# Altium schematic sheet EVQ4242-VE-00B_schematic.SchDoc
size A3
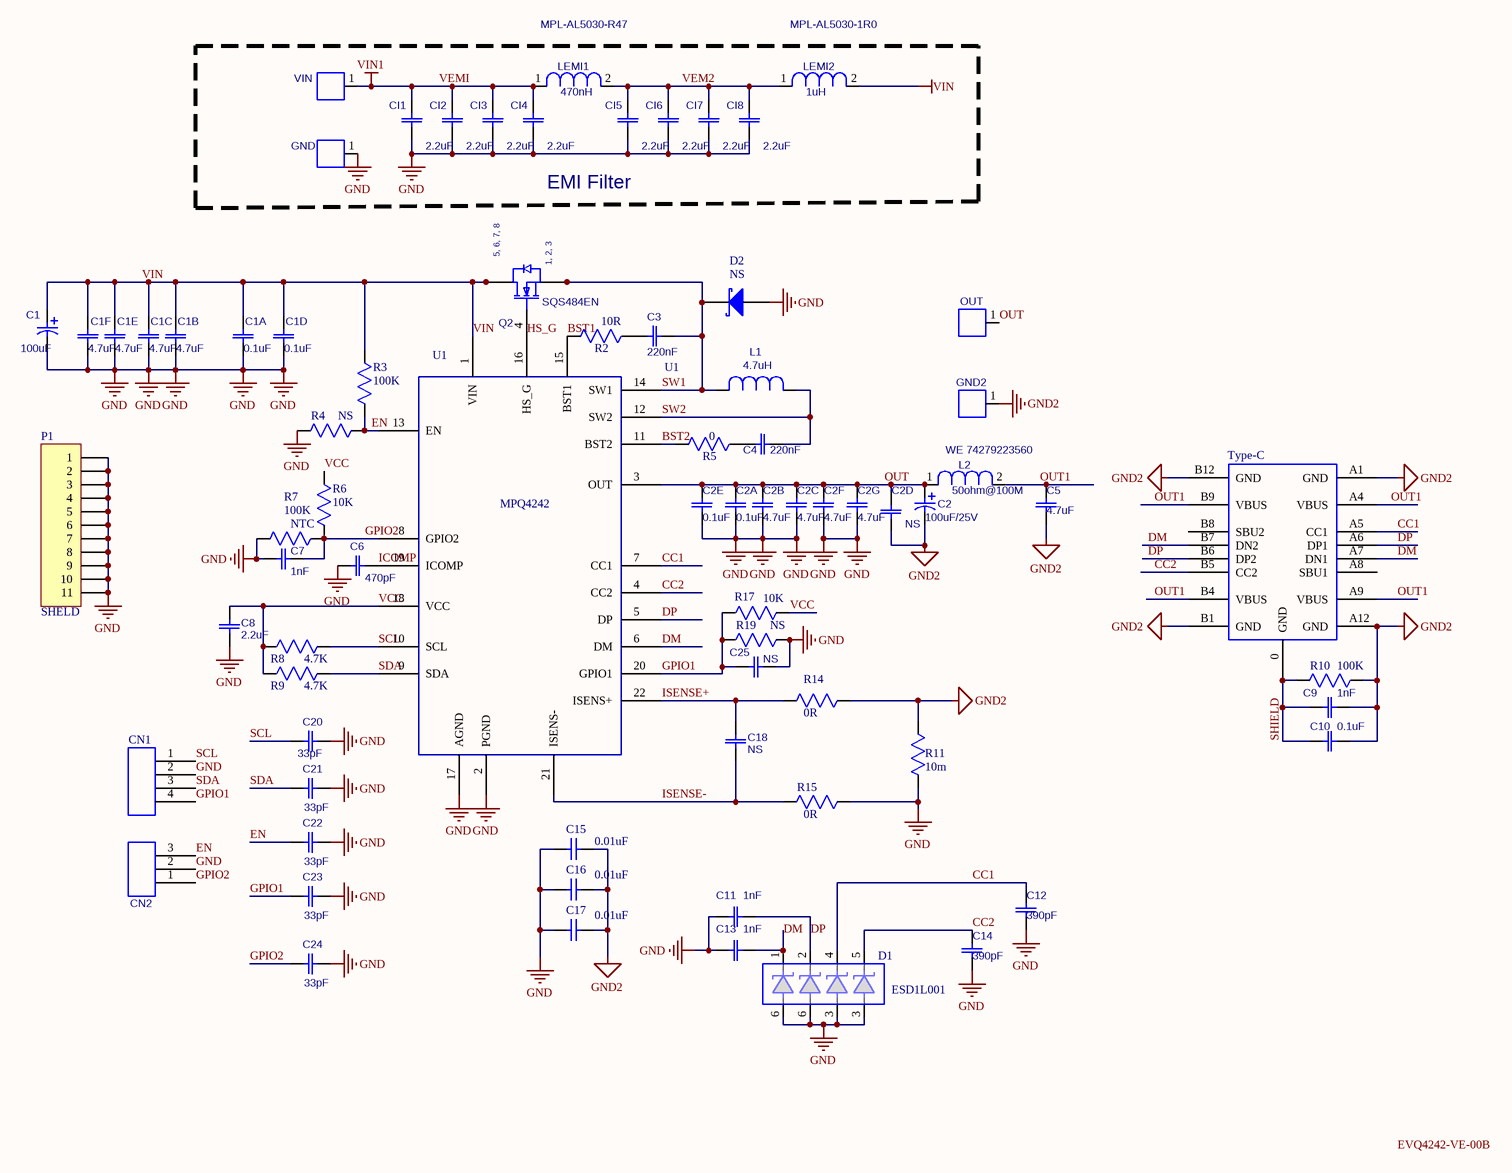
[diagram p0: EVQ4242-VE-00B_schematic.SchDoc]

## Parts
C1  value 100uF  [CAP/ELECT/SMD/C6]  (hidden comment: CAP/ELECT/DIP/OD5.3P2.0)
C1A  value 0.1uF  [CAP/0402]  (hidden comment: CAP\0603)
C1B  value 4.7uF  [CAP/0805]  (hidden comment: CAP\0603)
C1C  value 4.7uF  [CAP/0805]
C1D  value 0.1uF  [CAP/0402]  (hidden comment: CAP\0603)
C1E  value 4.7uF  [CAP/0805]  (hidden comment: CAP\0603)
C1F  value 4.7uF  [CAP/0805]
C2  value 100uF/25V  [6.6mm*6.6mm]  (hidden comment: CAP/ELECT/DIP/OD5.3P2.0)
C2A  value 0.1uF  [CAP/0402]  (hidden comment: CAP\0603)
C2B  value 4.7uF  [CAP/0805]  (hidden comment: CAP\0603)
C2C  value 4.7uF  [CAP/0805]  (hidden comment: CAP\0603)
C2D  value NS  [CAP/0805]  (hidden comment: CAP\0603)
C2E  value 0.1uF  [CAP/0402]  (hidden comment: CAP\0603)
C2F  value 4.7uF  [CAP/0805]  (hidden comment: CAP\0603)
C2G  value 4.7uF  [CAP/0805]  (hidden comment: CAP\0603)
C3  value 220nF  [CAP/0402]  (hidden comment: CAP\0603)
C4  value 220nF  [CAP/0402]  (hidden comment: CAP\0603)
C5  value 4.7uF  [CAP/0603]  (hidden comment: CAP\0603)
C6  value 470pF  [CAP/0402]  (hidden comment: CAP\0603)
C7  value 1nF  [CAP/0603]  (hidden comment: CAP\0603)
C8  value 2.2uF  [CAP/0402]  (hidden comment: CAP\0603)
C9  value 1nF  [CAP/0603]  (hidden comment: CAP\0603)
C10  value 0.1uF  [CAP/0603]  (hidden comment: CAP\0603)
C11  value 1nF  [CAP/0402]  (hidden comment: CAP\0603)
C12  value 390pF  [CAP/0402]  (hidden comment: CAP\0603)
C13  value 1nF  [CAP/0402]  (hidden comment: CAP\0603)
C14  value 390pF  [CAP/0402]  (hidden comment: CAP\0603)
C15  value 0.01uF  [CAP/0402]  (hidden comment: Cap)
C16  value 0.01uF  [CAP/0402]  (hidden comment: Cap)
C17  value 0.01uF  [CAP/0402]  (hidden comment: Cap)
C18  value NS  [CAP/0402]  (hidden comment: CAP\0603)
C20  33pF  [CAP0603]
C21  33pF  [CAP0603]
C22  33pF  [CAP0603]
C23  33pF  [CAP0603]
C24  33pF  [CAP0603]
C25  value NS  [CAP/0603]  (hidden comment: CAP\0603)
CI1  value 2.2uF  [CAP0603]  (hidden comment: CAP0603)
CI2  value 2.2uF  [CAP0603]  (hidden comment: CAP0603)
CI3  value 2.2uF  [CAP0603]  (hidden comment: CAP0603)
CI4  value 2.2uF  [CAP0603]  (hidden comment: CAP0603)
CI5  value 2.2uF  [CAP0603]  (hidden comment: CAP0603)
CI6  value 2.2uF  [CAP0603]  (hidden comment: CAP0603)
CI7  value 2.2uF  [CAP0603]  (hidden comment: CAP0603)
CI8  value 2.2uF  [CAP0603]  (hidden comment: CAP0603)
CN1  HEADER 4  [HEADER 1X4]  (value not drawn)
CN2  AC  [CONN/3PIN/2.54MM]  (value not drawn)
D1  ESD1L001  [ESD0001]
D2  NS  [SOD123]
GND  CONN/1MM  [TP/2MM]  (value not drawn)
GND2  CONN/TP  [TP/2MM]  (value not drawn)
L1  value 4.7uH  [7443551470]  (hidden comment: COILCRAFT/LPO2506IB-682)
L2  value 50ohm@100M  Package: WE 74279223560  [sm1206]  (hidden comment: L-10X10)
LEMI1  value 470nH  Package: MPL-AL5030-R47  [L5030]  (hidden comment: TDK-2520)
LEMI2  value 1uH  Manufacturer P/N: MPL-AL5030-1R0  [L5030]  (hidden comment: TDK-2520)
OUT  CONN/TP  [TP/2MM]  (value not drawn)
P1  SHELD  [sheld]
Q2  SQS484EN  value U1  [SQS484EN]
R2  value 10R  [RES0402]  (hidden comment: RES/DIP/1/2W)
R3  value 100K  [RES0603]  (hidden comment: RES/DIP/1/2W)
R4  value NS  [RES0603]  (hidden comment: RES/DIP/1/2W)
R5  value 0  [RES0402]  (hidden comment: RES/DIP/1/2W)
R6  value 10K  [RES0603]  (hidden comment: RES/DIP/1/2W)
R7  value NTC  [RES0603]  (hidden comment: RES/DIP/1/2W)
R8  value 4.7K  [RES0603]  (hidden comment: RES/DIP/1/2W)
R9  value 4.7K  [RES0603]  (hidden comment: RES/DIP/1/2W)
R10  value 100K  [RES0603]  (hidden comment: RES/DIP/1/2W)
R11  value 10m  [l1508]  (hidden comment: RES/DIP/1/2W)
R14  value 0R  [RES0402]  (hidden comment: RES/DIP/1/2W)
R15  value 0R  [RES0402]  (hidden comment: RES/DIP/1/2W)
R17  value 10K  [RES0603]  (hidden comment: RES/DIP/1/2W)
R19  value NS  [RES0603]  (hidden comment: RES/DIP/1/2W)
Type-C  New Type_c  [New Type-C]  (value not drawn)
U1  MPQ4242  [QFN-22 (4mm×5mm)]
VIN  CONN/2MM  [TP/2MM]  (value not drawn)

## Blocks framed on the sheet
EMI Filter: CI1-CI8 GND LEMI1 LEMI2 VIN

## Nets
GND: C1.2 C1A.1 C1B.1 C1C.1 C1D.1 C1E.1 C1F.1 C2A.2 C2B.2 C2C.2 C2E.2 C2F.2 C2G.2 C6.1 C7.1 C8.2 C11.1 C12.2 C13.1 C14.2 C15.1 C16.1 C17.1 C20.1 C21.1 C22.1 C23.1 C24.1 C25.2 CI1.1 CI2.1 CI3.1 CI4.1 CI5.1 CI6.1 CI7.1 CI8.1 CN1.2 CN2.2 D1.3 D1.6 D2.1(A) GND.1 P1.1 P1.2 P1.3 P1.4 P1.5 P1.6 P1.7 P1.8 P1.9 P1.10 P1.11 R4.2 R7.2 R11.1 R15.2 R19.2 U1.2(PGND) U1.17(AGND)
GND2: C2.2 C2D.2 C5.2 C9.2 C10.2 C15.2 C16.2 C17.2 GND2.1 R10.2 R11.2 R14.1 Type-C.A1(GND) Type-C.A12(GND) Type-C.B1(GND) Type-C.B12(GND)
VEMI: CI1.2 CI2.2 CI3.2 CI4.2 LEMI1.1 VIN.1  [also labelled VIN1]
VIN: C1.1 C1A.2 C1B.2 C1C.2 C1D.2 C1E.2 C1F.2 LEMI2.2 Q2.5(D) Q2.6(D) Q2.7(D) Q2.8(D) R3.2 U1.1(VIN)
BST1: R2.1 U1.15(BST1)
BST2: R5.1 U1.11(BST2)
CC1: C12.1 D1.4 Type-C.A5(CC1) U1.7(CC1)
CC2: C14.1 D1.5 Type-C.B5(CC2) U1.4(CC2)
DM: C13.2 D1.1 Type-C.A7(DN1) Type-C.B7(DN2) U1.6(DM)
DP: C11.2 D1.2 Type-C.A6(DP1) Type-C.B6(DP2) U1.5(DP)
EN: C22.2 CN2.3 R3.1 R4.1 U1.13(EN)
GPIO1: C23.2 C25.1 CN1.4 R17.1 R19.1 U1.20(GPIO1)
GPIO2: C7.2 C24.2 CN2.1 R6.1 R7.1 U1.8(GPIO2)
HS_G: Q2.4(G) U1.16(HS_G)
ICOMP: C6.2 U1.19(ICOMP)
ISENSE+: C18.1 R14.2 U1.22(ISENS+)
ISENSE-: C18.2 R15.1 U1.21(ISENS-)
OUT: C2.1 C2A.1 C2B.1 C2C.1 C2D.1 C2E.1 C2F.1 C2G.1 L2.1 OUT.1 U1.3(OUT)
OUT1: C5.1 L2.2 Type-C.A4(VBUS) Type-C.A9(VBUS) Type-C.B4(VBUS) Type-C.B9(VBUS)
SCL: C20.2 CN1.1 R8.2 U1.10(SCL)
SDA: C21.2 CN1.3 R9.2 U1.9(SDA)
SHIELD: C9.1 C10.1 R10.1 Type-C.0(GND)
SW1: C3.1 D2.2(K) L1.1 Q2.1(S) Q2.2(S) Q2.3(S) U1.14(SW1)
SW2: C4.1 L1.2 U1.12(SW2)
VCC: C8.1 R6.2 R8.1 R9.1 R17.2 U1.18(VCC)
VEM2: CI5.2 CI6.2 CI7.2 CI8.2 LEMI1.2 LEMI2.1
NetC3_2: C3.2 R2.2
NetC4_2: C4.2 R5.2

Not connected (* = marked no-connect by the designer): CN2 4 5; Type-C A8(SBU1) B8(SBU2)

## Notes on the sheet
- Labels drawn without touching a wire or pin: EVQ4242-VE-00B
- (in symbol AM4392N) 5, 6, 7, 8; 1, 2, 3
- (in symbol RES/DIP/1/2W) 100K

## Library data of the parts
C1 C2 = 07.0271: Electrolytic Capacitor;50V;Electrolytic;DIP; Manufacturer: {Manufacturer}; Manufacturer P/N: {Manufacturer P/N}; Part_Name: CD281L-50V22; Pid: 907; Out_Num: 0; Available_Num: 344; CName: Jiao Zhang; Package: DIP; Part Number: 07.0271; Spec: Electrolytic Capacitor; Manufacture_PN: CD281L-50V22; Stock_Num: 344; Ctime: 2010/8/2 11:39:09; UPName: Jiao Zhang; UPtime: 2010/8/2 11:39:09
C1A C1B C1D C1E C2A C2B C2C C2D C2E C2F C2G C3-C8 C12 C14 C18 C25 = CAP0603: Manufacturer: {Manufacturer}; Manufacturer P/N: {Manufacturer P/N}; Description: {Description}
  C1A C1B C1D C1E C2A C2B C2C C2D C2E C2F C2G C3-C7 C12 C14 C18 C25: Package: SM/C_0603
C1C C1F = CAP1210: Manufacturer: TDK; Manufacturer P/N: C3225X7R1H225K; Description: Ceramic Cap., 50V, X7R; Package: SM/C_1210
C9 = CAP0603: Ceramic Cap.,50V,X7R; Manufacturer: WE; Manufacturer P/N: 885012206083; Package: 0603
C10 = CAP0603: Ceramic Cap.,50V,X7R; Manufacturer: WE; Manufacturer P/N: 885012206095; Package: 0603
C11 C13 = CAP0603: Ceramic Cap.,50V,C0G; Manufacturer: Murata; Manufacturer P/N: GRM1885C1H391JA01D; Package: 0603
C15-C17 = Cap: Capacitor; Manufacturer: muRata; Manufacturer P/N: GRM32E(1210)/31D(1206)21A(0805)188(0603)R71H106KL; Package: 0603
C20-C24 = CAP0402: {Description}; Manufacturer: {Manufacturer}; Manufacturer P/N: {Manufacturer P/N}; Package: 0603; Value: 33pF
CI1-CI8 = CAP0603: {Description}; Manufacturer: {Manufacturer}; Manufacturer P/N: {Manufacturer P/N}; Package: {Package}
D1 = ESD1L001: ESD Diode; Manufacturer P/N: ESD1L001W1T2G; Manufacturer: Onsemi; Value: ESD1L001; Package: SOT-363-6
D2 = D Schottky: Schottky Diode
GND VIN = CONN/2MM: {Description}; Value: *
GND2 OUT = CONN/TP: {Description}; Manufacturer P/N: {Manufacturer P/N}; Manufacturer: {Manufacturer}; Package: {Package}; Value: *
L1 = TOKO106C: Manufacturer: {Manufacturer}; Manufacturer P/N: {Manufacturer P/N}; Description: {Description}; Package: {Package}
L2 = L-10X10: {Description}; Manufacturer: {Manufacturer}; Manufacturer P/N: {Manufacturer P/N}
LEMI1 = TDK-2520: Inductor, 1.45A, D62LCB; Manufacturer: Toko; Manufacturer P/N: A918CY-6R2M
LEMI2 = TDK-2520: Inductor, 1.45A, D62LCB; Manufacturer: Toko
Q2 = AM4392N
U1 = QFN-22 (4MM*5MM): Buck-boost converter
CN2 = AC: Value: *